# Altium schematic sheet Accelerometer.SchDoc
size A4; DocumentNumber: 6; SheetNumber: 7; SheetTotal: 11
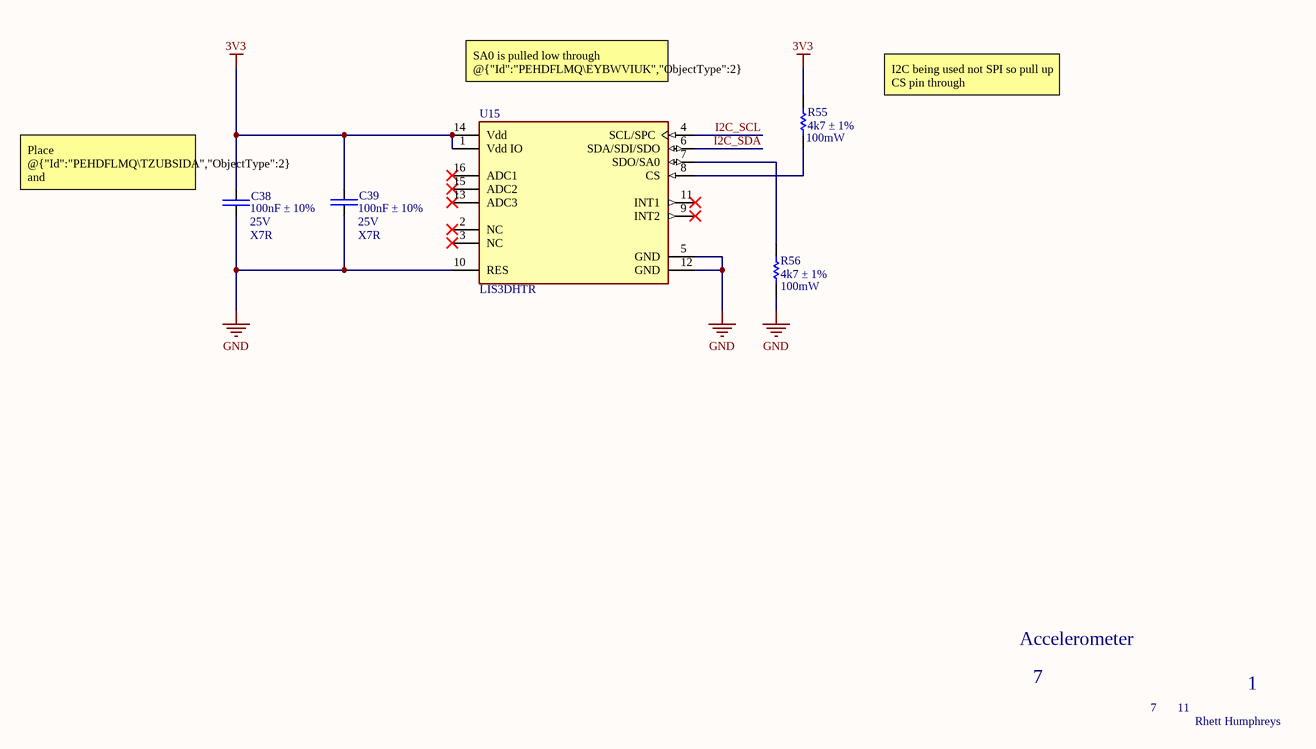
[diagram p0: Accelerometer.SchDoc]

## Parts
C38  100nF ± 10%  [CAP-0603]
C39  100nF ± 10%  [CAP-0603]
R55  4k7 ± 1%  [RESC1609X50X30NL8T20]
R56  4k7 ± 1%  [RESC1609X50X30NL8T20]
U15  LIS3DHTR  [FP-LGA-16-7983231-MFG]

## Nets
3V3: C38.2 C39.2 R55.2 U15.1(Vdd_IO) U15.14(Vdd)
GND: C38.1 C39.1 R56.1 U15.5(GND) U15.10(RES) U15.12(GND)
I2C_SCL: U15.4(SCL/SPC)
I2C_SDA: U15.6(SDA/SDI/SDO)
NetR55_1: R55.1 U15.8(CS)
NetR56_2: R56.2 U15.7(SDO/SA0)

Not connected (* = marked no-connect by the designer): U15 2(NC)* 3(NC)* 9(INT2)* 11(INT1)* 13(ADC3)* 15(ADC2)* 16(ADC1)*

## Notes on the sheet
- SA0 is pulled low through @{"Id":"PEHDFLMQ\EYBWVIUK","ObjectType":2} so I2C address is 0x18
- I2C being used not SPI so pull up CS pin through @{"Id":"PEHDFLMQ\PWWKWBSP","ObjectType":2}
- (near R55) 100mW
- (near C38) Place @{"Id":"PEHDFLMQ\TZUBSIDA","ObjectType":2} and @{"Id":"PEHDFLMQ\UJDGWTQV","ObjectType":2} as close as possible to Vdd and Vdd IO pins of @{"Id":"PEHDFLMQ\OSLWRHKS","ObjectType":2} respectively.
- (near C38) 25V
- (near C38) X7R
- (near C39) 25V
- (near C39) X7R
- (near R56) 100mW
- Accelerometer
- 7
- 11
- 1
- Rhett Humphreys

## Library data of the parts
C38 C39 = CAP-0603: Capacitor chip unpolarized. 0603
R55 R56 = CMP-1666-00005-4: Chip Resistor, 10 KOhm, +/- 1%, 100 mW, -55 to 155 degC, 0603 (1608 Metric), RoHS, Tape and Reel; Manufacturer: Vishay Semiconductor; Voltage Rating: 75 V; Max Operating Temperature: 155 degC; PackageDescription: 2-Pin Surface Mount Device, Body 1.575 x 0.85 mm; ComponentLink1Description: Manufacturer URL; RoHSCompliant: true; PackageReference: 0603; REACH SVHC: Unknown; Length: 1.55 mm; DatasheetVersion: 06/2012; Packaging: Tape and Reel; Min Operating Temperature: -55 degC; Mounting Technology: Surface Mount; ComponentLink2URL: https://datasheet.ciiva.com/11809/0900766b80d98afc-11809037.pdf; Height: 0.45 mm; ComponentLink2Description: Datasheet; Package Quantity: 5000; ComponentLink1URL: http://www.vishay.com/
U15 = CMP-0234-00055-6: ACCEL 2-16G I2C/SPI 16LGA; Max Supply Voltage: 3.6V; Bandwidth: 5kHz; Min Supply Voltage (DC): 1.71V; Interface: I2C; Axis: X, Y, Z; Operating Supply Voltage: 2.5V; Operating Supply Current: 11uA; Output Type: Digital; Resolution: 16b; Sensor Type: 3 Axis; Series: -; Package Quantity: 1; Case/Package: LGA; Radiation Hardening: No; Min Operating Temperature: -40°C; Length: 3mm; Max Supply Voltage (DC): 3.6V; Lead Free: Lead Free; Height: 1mm; Number of Pins: 16; RoHS Compliant: Yes; Packaging: Tape and Reel; Width: 3mm; Contact Plating: Gold; Max Operating Temperature: 85°C; Min Supply Voltage: 1.71V; REACH SVHC: No SVHC; Depth: 3mm